# Altium schematic sheet Smart Control and Security System.SchDoc (part 2 of 2)
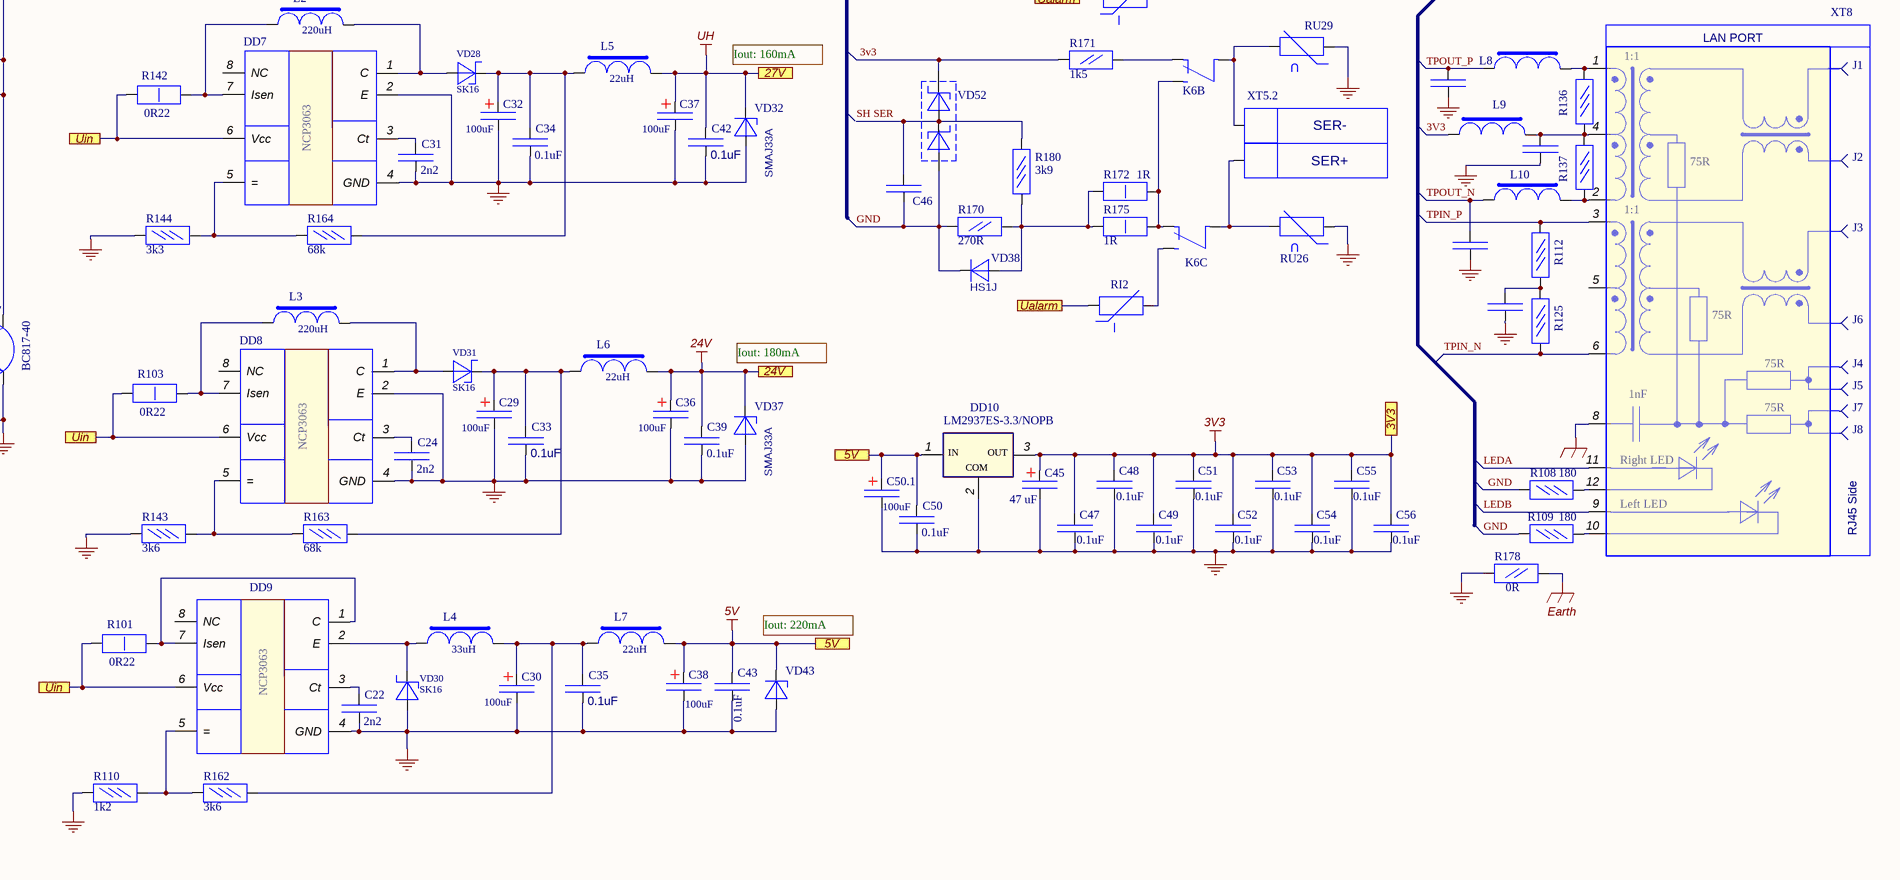
[diagram p4: Smart Control and Security System.SchDoc, bottom right]

## Library data of the parts
BT1 = Battery: Multicell Battery; Value: CR2032; Function: Battery Holder; Voltage: 3V; PackageDescription: CR2032 Coin Battery Holder; 2 Leads; Package Reference: KLS5-CR2032-01
C1-C10 C47-C49 C51-C56 C62 = Cap1: Capacitor GOST; Voltage: 50V; Dielectric: X7R; Tolerance: 5%/10%; PackageDescription: Chip Capasitor; Package Reference: CC0603; Supplier Part Number: GRM188R71H104K; Supplier: Murata Manufacturing
C11 = Cap1: Capacitor GOST; Voltage: 50V; Dielectric: X7R; Value: 0.1uF; Tolerance: 5%/10%; Value2: 470uF; PackageDescription: Chip Capasitor; Package Reference: CC0603; Supplier Part Number: GRM188R71H104K; Supplier: Murata Manufacturing
C12 C14 = Cap1: Capacitor GOST; Voltage: 50V; Dielectric: NPO; Value: 33pF; Tolerance: 5%; PackageDescription: Chip Capasitor; Package Reference: CC0603; Supplier Part Number: GRM1885C1H330J; Supplier: Murata Manufacturing
C13 C22 C24-C28 C31 C33-C35 C39 C40 C42 C43 C50 = Cap1: Capacitor GOST; Voltage: 50V; Function: CVCC; Dielectric: X7R; Tolerance: 5%/10%; PackageDescription: Chip Capasitor; Package Reference: CC0805; Supplier: Murata Manufacturing
  C13 C25-C28 C33-C35 C39 C40 C42 C43 C50: Supplier Part Number: GRM21BR71H104K
  C22 C24 C31: Supplier Part Number: GRM216R71H223K
C15 C16 C18-C20 C23 C41 C46 C57-C60 = Cap1: Capacitor GOST; Voltage: 50V; Dielectric: X7R; Value: 0.1uF; Tolerance: 5%/10%; PackageDescription: Chip Capasitor; Package Reference: CC0603; Supplier Part Number: GRM188R71H104K; Supplier: Murata Manufacturing
C17 = Cap Pol: Cap Pol GOST; Tolerance: 10%; Function: Tantalum Capasitor; Voltage: 16V; Supplier: *; PackageDescription: Case_A
C21 C21.1 C61 = Cap Pol: Cap Pol GOST; Tolerance: 10%; Voltage: 50V; Supplier: Jamicon; PackageDescription: Radial, Thru-Hole Body 6.3x11.0 (DxH)mm, Pitch 2.5mm; Supplier Part Number: TKR470M1HE11
C29 C30 C32 C36 C37 = Cap Pol: Cap Pol GOST; Tolerance: 10%; Voltage: 35V; Supplier: Jamicon; PackageDescription: Radial, Thru-Hole Body 6.3x11.0 (DxH)mm, Pitch 2.5mm; Supplier Part Number: TKR101M1VE11
C38 C50.1 = Cap Pol: Cap Pol GOST; Tolerance: 10%; Voltage: 10V; Supplier: Jamicon; PackageDescription: Radial, Thru-Hole Body 6.3x11.0 (DxH)mm, Pitch 2.5mm; Supplier Part Number: TKR101M1AD11
C45 = Cap Pol: Cap Pol GOST; Tolerance: 10%; Function: Electrolytic Aluminum Capasitor; Voltage: 16V; Supplier: *; PackageDescription: Radial, Thru-Hole Body 13.0x25.0 (DxH)mm, Pin Spacing 5.0mm
DD1 = 24LC512-I/SM: Function: EEPROM 1Mbit; Supplier: Atmel; Value: 24LC512; PackageDescription: SOIC-8
DD2 = 24LC512-I/SM: Function: EEPROM; Value2: AT24CMO1; Supplier: Microchip Technology Inc; Value: 24LC512-I/SM; PackageDescription: SOIC-8
DD3 = PIC18F97J60-IP/T: 100pin TQFP; Functuion: MCU; PackageReference: 100-TQFP 12x12x1mm Body; Supplier 1: Microchip Technology Inc; PackageDescription: 100-Lead Plastic Thin Quad Flatpack 12x12x1mm Body
DD4 = MAX48xx: MAX483EESA; Function: RS485 Transceiver; PackageReference: SO-8; PackageDescription: SOIC-8
DD5 = DS1307: Clock Real-Time; Function: Real-Time Clock; Supplier: Dallas; PackageDescription: SOIC-8
DD6 = AT45DB011D: FLASH_SPI; Supplier: Atmel; Function: FLASH_SPI; Value: AT45DB011D; PackageDescription: SOIC-8
DD7-DD9 = NCP3063: Function: DC/DC Convertor; Supplier: ON Semiconductor; Value: NCP3063; PackageDescription: SOIC-8
DD10 = MC78M05BDT: Voltage Regulator Gost; Functuion: Positive Voltage Regulator 3v3, 0.5A; PackageReference: TO-263
HL1-HL12 = LED_R/G: KPB-3025SURKCGKC; PackageReference: SMD3025; PackageDescription: SMT LED; 4 Flat Leads; Value: KPB-3025SURKCGKC; Supplier Part Number: 12; Supplier: Kingbright
HL13 = LED1_Gost_2: Nichia157 LED; Value: BL-LS0603UGC; Color: Green; Value2: KPT-1608ID; PackageDescription: LED SMD_0603; 2 Flat Leads
K1-K6 = RTE24024: Two-Pole Dual-Throw Relay 24VDC; Function: Relay 2 pole, 2 CO contacts; Value: RTE24024; Supplier Part Number: 1-1393243-0 (RTE24024); Supplier: Tyco Electronics
L1 L5-L7 L11 = Choke SMD: Value: SDR0805-220ML; Function: Choke; Package: SDR 0805; Supplier Part Number: SDR0805-220ML; Supplier: Bourns
L2 L3 = Choke SMD: Value: SDR0805-221KL; Function: Choke; Package: SDR 0805; Supplier Part Number: SDR0805-221KL; Supplier: Bourns
L4 = Choke SMD: Value: SDR1006-330KL; Function: Choke; Package: SDR1006; Supplier Part Number: SDR1006-330KL; Supplier: Bourns
L8 L10 = Choke SMD: Function: Choke EMI; Value: BLM18EG221SN1D; Inductance: 220uH; Package: SDR 0603; Supplier Part Number: BLM18EG221SN1D; Supplier: Murata Manufacturing
L9 = Choke SMD: Function: Choke EMI; Value: BLM21PG331SN1D; Inductance: 330uH; Package: SDR 0805; Supplier Part Number: BLM21PG331SN1D; Supplier: Murata Manufacturing
R1-R10 R21 R23-R31 = Res 1W: Resistor GOST; Part Number: RC2512JR-07510RL; Tolerance: 5%; PackageDescription: SMD Resistor 1W; PackageReference: CR2512; Supplier Part Number: *
R11-R20 = Res 1/8W: Resistor GOST; Part Number: RC0805FR-076K8L; Tolerance: 1%; PackageDescription: SMD Resistor 0.125W; PackageReference: CR 0805
R32-R41 R102 = Res 1/16W: CR0603 GOST; Part Number: RC0603FR-072KL; Tolerance: 1%; PackageReference: RC0603
  R32-R41: PackageDescription: SMD Resistor 0.1W
  R102: PackageDescription: Chip 0603
R42-R51 R62-R71 = Res 1/8W: Resistor GOST; Part Number: RC0805FR-0722KL; Tolerance: 1%; PackageDescription: Chip Resistor, Body 2.0x1.3mm,; PackageReference: CR 0805
R52-R61 R72-R81 = Res 1/8W: Resistor GOST; Part Number: RC0805JR-0747KL; Tolerance: 1%; PackageDescription: Chip Resistor, Body 2.0x1.3mm,; PackageReference: CR 0805
R82-R84 R95-R98 = Res 1/16W: CR0603 GOST; Part Number: RC0603JR-073K9L; Tolerance: 1%; PackageDescription: Chip 0603; PackageReference: RC0603
R85 R88-R90 R94 R104-R106 = Res 1/16W: CR0603 GOST; Part Number: RC0603FR-07270RL; Tolerance: 1%; PackageDescription: Chip 0603; PackageReference: RC0603
R86 R87 R91-R93 R160 = Res 1/16W: CR0603 GOST; Part Number: RC0603FR-073K9L; Tolerance: 1%; PackageDescription: Chip 0603; PackageReference: RC0603
R99 R100 = Res 1/16W: CR0603 GOST; Part Number: RC0603JR-071K5L; Tolerance: 1%; PackageDescription: Chip 0603; PackageReference: RC0603
R101 R103 R142 = Res 1W: Resistor GOST; PackageDescription: CR2512; PackageReference: *; Part Number: *
R107 = Res 1/16W: CR0603 GOST; Part Number: RC0603FR-0710KL; Tolerance: 1%; PackageDescription: Chip 0603; PackageReference: RC0603
R108 R109 = Res 1/16W: CR0603 GOST; Part Number: RC0603FR-07180RL; Tolerance: 1%; PackageDescription: Chip 0603; PackageReference: RC 0603
R110 = Res 1/16W: CR0603 GOST; Part Number: RC0603FR-071K2L; Tolerance: 1%; PackageDescription: Chip 0603; PackageReference: RC0603
R111 R141 = Res 1/16W: CR0603 GOST; Part Number: RC0603JR-074K7L; Tolerance: 1%; PackageDescription: Chip 0603; PackageReference: RC0603
R112 R125 R137 = Res 1/16W: CR0603 GOST; Part Number: RC0603FR-0749R9L; Value: 49.9; Tolerance: 1%; PackageDescription: Chip 0603; PackageReference: RC 0603
R113-R122 R146-R159 R166-R169 = Res 1/4W: Resistor GOST; Part Number: RC1206JR-07160RL; Tolerance: 5%; PackageDescription: RC1206; Function: *
R123 R124 R126 R127 = Res 1/4W: Resistor GOST; Part Number: RC1206JR-075K6L; Tolerance: 5%; PackageDescription: RC1206; Function: *
R128-R131 = Res 1/4W: Resistor GOST; Part Number: RC1206JR-077K5L; Tolerance: 5%; PackageDescription: RC1206; Function: *
R132 R161 R170 = Res 1/8W: Resistor GOST; Part Number: RC0805FR-0715RL; Tolerance: 1%; PackageDescription: SMD Resistor 0.125W; PackageReference: CR 0805
R133 = Res 1/8W: Resistor GOST; Part Number: RC0805FR-0724KL; Tolerance: 1%; PackageDescription: Chip Resistor, Body 2.0x1.3mm,; PackageReference: CR 0805
R134 = Res 1/16W: CR0603 GOST; Part Number: RC0603FR-072K7L; Tolerance: 1%; PackageDescription: Chip 0603; PackageReference: RC0603
R135 = Res 1/16W: CR0603 GOST; Part Number: RC0603FR-07300RL; Tolerance: 1%; PackageDescription: Chip 0603; PackageReference: RC0603
R136 = Res 1/16W: CR0603 GOST; Part Number: RC0603FR-0749R9L; Value: 49.9 R; Tolerance: 1%; PackageDescription: Chip 0603; PackageReference: RC 0603
R138 R171 = Res 1/8W: Resistor GOST; Part Number: RC0805FR-0710KL; Tolerance: 1%; PackageReference: CR0805
R140 R172 R173 R175 = Res 1W: Resistor GOST; Part Number: RC2512FR-071RL; PackageDescription: SMD Resistor 1W; PackageReference: CR2512
R143 R162 = Res 1/16W: CR0603 GOST; Part Number: RC0603FR-073K6L; Tolerance: 1%; PackageDescription: Chip 0603; PackageReference: RC0603
R144 = Res 1/16W: CR0603 GOST; Part Number: RC0603FR-073K3L; Tolerance: 1%; PackageDescription: Chip 0603; PackageReference: RC0603
R145 R179 = Res 1/16W: CR0603 GOST; Part Number: RC0603FR-0730KL; Tolerance: 1%; PackageDescription: Chip 0603; PackageReference: RC0603
R163 R164 = Res 1/16W: CR0603 GOST; Part Number: RC0603FR-0768KL; Tolerance: 1%; PackageDescription: Chip 0603; PackageReference: RC0603
R165 R174 R180 = Res 1/16W: CR0603 GOST; Part Number: RC0603JR-07100KL; Tolerance: 1%; PackageDescription: Chip 0603; PackageReference: RC0603
R176 R177 = Res 1/16W: CR0603 GOST; Part Number: RC0603JR-0747KL; Tolerance: 1%; PackageDescription: Chip 0603; PackageReference: RC0603
R178 = Res 1/8W: Resistor GOST; Part Number: RC0805JR-070RL; Tolerance: 1%; PackageDescription: SMD Resistor 0.125W; PackageReference: CR 0805
RI1 = MF-MSMF010: MultiFuse; Value: MF-R135; Current hold: 1.35A; Current break: 1.85A; Value2: MF-R250; Function: MultiFuse; Package: DIP; Supplier Part Number: MF-R135, 1.35 А; Supplier: Raychem; Supplier 2: Bourns
RI2 RI3 = MF-MSMF010: MultiFuse; Value: MF-MSMF050; Current hold: 500mA 12V; Function: MultiFuse; Package: CR 1812; Supplier Part Number: MF-MSMF050, 0.50А, 1812; Supplier: Bourns
RI4 RI7 = MF-MSMF010: MultiFuse; Value: MF-MSMF030; Current hold: 300mA 12V; Function: MultiFuse; Package: CR 1812; Supplier Part Number: MF-MSMF030, 0.30А, 1812; Supplier: Bourns
RI5 RI6 = MF-MSMF010: MultiFuse; Current hold: 100mA 12V; Function: MultiFuse; Value: MF-MSMF010; Package: CR 1812; Supplier Part Number: MF-MSMF010, 0.10А, 1812; Supplier: Bourns
RU1-RU20 RU25-RU27 RU29 = Varistor_hor: Varistor GOST; Function: Varistor 40 V; Value: CN1206K35G(H); Value2: B72520-V0400-K062; PackageReference: *; PackageDescription: CN1206; Supplier: Epcos; Supplier Part Number: B72520-V0400-K062
  RU1: Value2: Value2
RU21-RU24 RU24.1 RU28 RU30-RU37 = Varistor: Varistor GOST; Function: Varistor 14V; Value: B72520-V 140-K62; Value2: CN1206K14G; PackageReference: *; PackageDescription: CN1206; Supplier Part Number: B72520-V 140-K62; Supplier: Epcos
VD1-VD10 VD49 VD52 VD53 = BAS70-04: Diode Schottky Double 70mA 70V; Function: Diode Schottky Double; PackageReference: *; PackageDescription: SOT-23; Value: BAS70-04; Supplier Part Number: BAS70-04,215; Supplier: NXP Semiconductor
VD11-VD20 = BAV99W: Diode GOST; Function: Swithing doube diode; Value: BAV-99W; PackageDescription: SOT-323; PackageReference: *; Part Number: *
VD21-VD26 VD33-VD36 VD39-VD42 VD61 = Diode LL4148: Diode LL4148 (GOST); Package Description: miniMELF (SOD-80); Part Number: LL4148; Function: *
  VD21-VD26 VD61: Value: ll4148
VD27 VD38 VD48 = Diode1: Diode GOST; Part Number: *; PackageDescription: Chip Diode; Body 4.5 x 3.2 mm (LxW typ); Function: *
  VD27: PackageReference: DO-214AA/SMB
  VD38 VD48: PackageReference: *
VD28 VD30 VD31 = Diode SK16: Diode Schottky GOST; Function: Diode Schottky 1A, 60B; PackageReference: SMB / DO-214AA; PackageDescription: *; Part Number: *
VD29 VD32 VD37 VD59 VD60 = Diode Zener: Diode Zener GOST; Function: TVS Diode; Part Number: *; PackageReference: *; PackageDescription: SMA/DO-214AC
VD43 = Diode Zener: Diode Zener GOST; Function: TVS Diode; Value: PESD5V0S1BA; Part Number: *; PackageReference: *; PackageDescription: SMA/DO-214AC
VD44-VD47 VD50 VD51 VD54-VD57 = Diode Zener: Diode Zener GOST; Function: Zener Diod 5V6; Value: BZV55C5V6; PackageReference: *; PackageDescription: miniMELF (SOD-80)
VT1-VT10 VT21-VT25 VT29 VT34-VT37 = BC817: NPN_SOT23; Functioun: N-P-N Bipolar Transistor. Bipolar NPN;; Parameters: Vceo=40V; Ic=500mA; PackageDescription: SOT-23; Supplier Part Number: BC817-40,215; Supplier: NXP Semiconductor
VT11-VT20 = BC807: PNP_SOT23; Functioun: P-N-P Bipolar Transistor; Parameters: Vceo=40V; Ic=500mA; PackageDescription: SOT-23; PackageReference: SOT-23; Supplier Part Number: BC807-40,215; Supplier: NXP Semiconductor
VT26-VT28 VT30-VT33 = BC847: NPN_SOT23; Functioun: Bipolar NPN; Vceo=40V; Ic=600mA; PackageDescription: SOT-23
  VT26-VT28 VT31-VT33: Supplier Part Number: BC817-40,215; Supplier: NXP Semiconductor
  VT30: PackageReference: *; Part Number: *
XT1.1 XT1.2 XT2.1-XT2.5 XT3.1-XT3.5 XT4.1-XT4.6 XT5.1 XT5.2 XT6 XT6.1 XT6.2 XT7.1-XT7.10 = Connect x2_1: Connect x2 GOST; Description: Terminal Block Connector 2pin; Value: KLS2-305V-5.00-02P-2S (DG305-5.0-02P-12); PackageDescription: Pitch 5.0 mm; Supplier: KLS electronic; Supplier Part Number: L-KLS2-305V-5.00-02P-2S
XT8 = LAN-Port: RJ-45, Filtered, 2LED; Value: KLS12-TL002-1x1-G/G-1-03 (SK02-111015NL); Description: Port RJ45, Filtered,  2 LED; Supplier: KLS; Supplier Part Number: KLS12-TL002-1x1-G/G-1-03 (SK02-111015NL)
XT9 = Connect x5: PLS 5 pin; Package: PLS 5pin
XT23 = Connect x2: PLS 2 pin; Package: PLS 2pin
ZQ1 = Buzzer: Sound Buzzer; Function: Sound Buzzer 5V, 14mm; Supplier Part Number: HPM14A; Supplier: JL World
ZQ2 ZQ3 = XTAL_1: Crystal Oscillator_Gost
  ZQ2: PackageReference: HC-49sm
  ZQ3: PackageReference: DT-26